# Altium schematic sheet io.SchDoc
size A
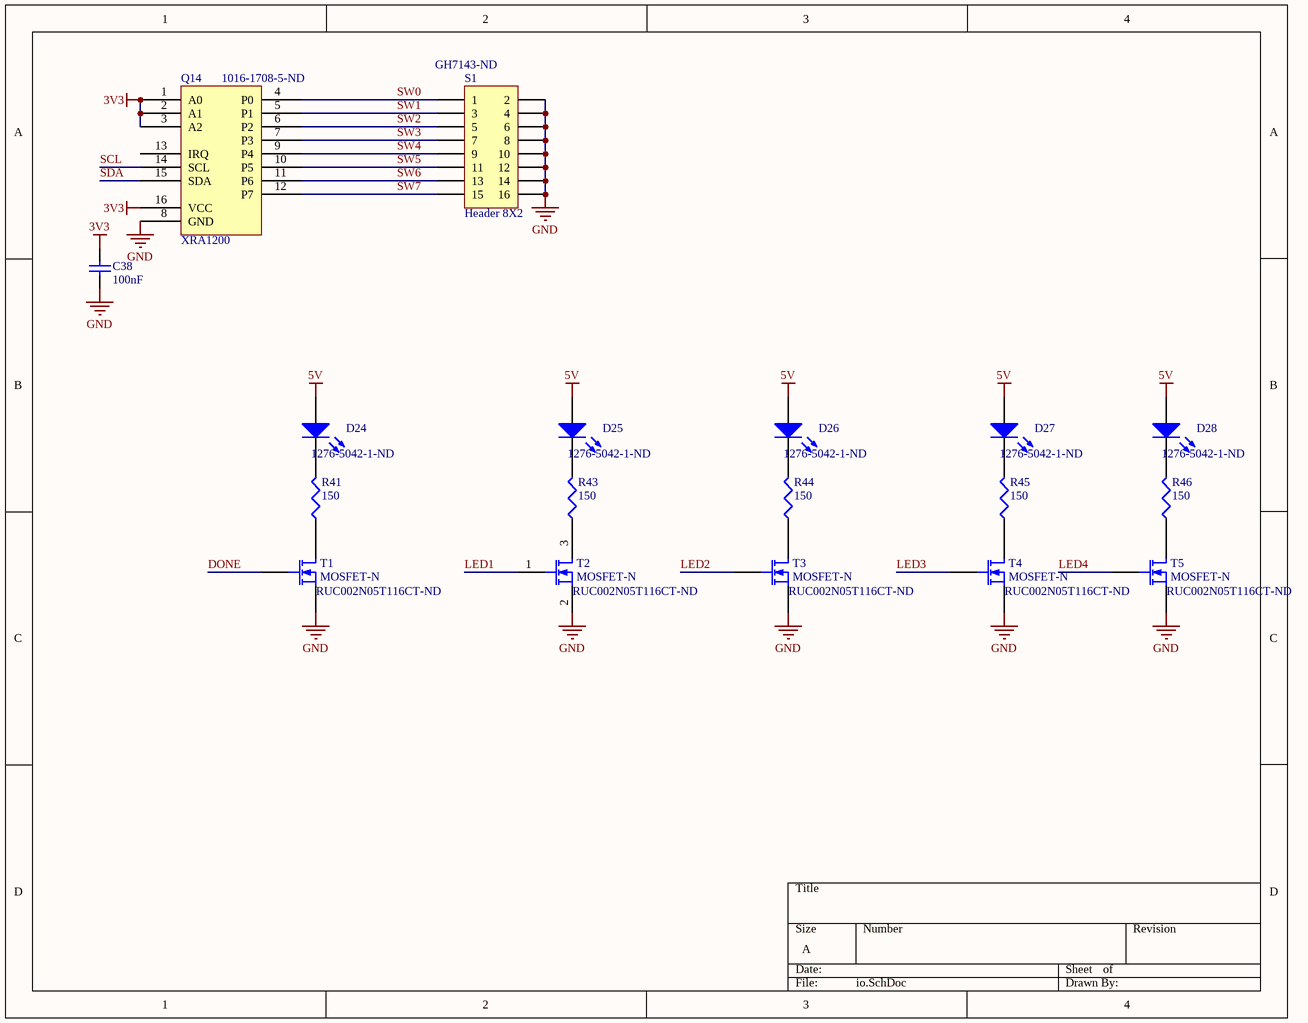
[diagram p0: io.SchDoc]

## Parts
C38  value 100nF  [CAPC1005X06L]  (hidden comment: Cap)
D24  LED2  [LED-0603]  (value not drawn)
D25  LED2  [LED-0603]  (value not drawn)
D26  LED2  [LED-0603]  (value not drawn)
D27  LED2  [LED-0603]  (value not drawn)
D28  LED2  [LED-0603]  (value not drawn)
Q14  XRA1200  Supplier Part Number 1: 1016-1708-5-ND  [TSOP65P640X120-16N]
R41  value 150  Supplier Part Number 1: 1276-5042-1-ND  [CAPC1608X90N]  (hidden comment: Res3)
R43  value 150  Supplier Part Number 1: 1276-5042-1-ND  [CAPC1608X90N]  (hidden comment: Res3)
R44  value 150  Supplier Part Number 1: 1276-5042-1-ND  [CAPC1608X90N]  (hidden comment: Res3)
R45  value 150  Supplier Part Number 1: 1276-5042-1-ND  [CAPC1608X90N]  (hidden comment: Res3)
R46  value 150  Supplier Part Number 1: 1276-5042-1-ND  [CAPC1608X90N]  (hidden comment: Res3)
S1  Header 8X2  Supplier Part Number 1: GH7143-ND  [76PSB08ST]
T1  MOSFET-N  Supplier Part Number 1: RUC002N05T116CT-ND  [SOT23-3]
T2  MOSFET-N  Supplier Part Number 1: RUC002N05T116CT-ND  [SOT23-3]
T3  MOSFET-N  Supplier Part Number 1: RUC002N05T116CT-ND  [SOT23-3]
T4  MOSFET-N  Supplier Part Number 1: RUC002N05T116CT-ND  [SOT23-3]
T5  MOSFET-N  Supplier Part Number 1: RUC002N05T116CT-ND  [SOT23-3]

## Nets
3V3: C38.2 Q14.1(A0) Q14.2(A1) Q14.3(A2) Q14.16(VCC)
5V: D24.A D25.A D26.A D27.A D28.A
GND: C38.1 Q14.8(GND) S1.2 S1.4 S1.6 S1.8 S1.10 S1.12 S1.14 S1.16 T1.2(S) T2.2(S) T3.2(S) T4.2(S) T5.2(S)
DONE: T1.1(G)
LED1: T2.1(G)
LED2: T3.1(G)
LED3: T4.1(G)
LED4: T5.1(G)
SCL: Q14.14(SCL)
SDA: Q14.15(SDA)
SW0: Q14.4(P0) S1.1
SW1: Q14.5(P1) S1.3
SW2: Q14.6(P2) S1.5
SW3: Q14.7(P3) S1.7
SW4: Q14.9(P4) S1.9
SW5: Q14.10(P5) S1.11
SW6: Q14.11(P6) S1.13
SW7: Q14.12(P7) S1.15
NetD24_K: D24.K R41.2
NetD25_K: D25.K R43.2
NetD26_K: D26.K R44.2
NetD27_K: D27.K R45.2
NetD28_K: D28.K R46.2
NetR41_1: R41.1 T1.3(D)
NetR43_1: R43.1 T2.3(D)
NetR44_1: R44.1 T3.3(D)
NetR45_1: R45.1 T4.3(D)
NetR46_1: R46.1 T5.3(D)

Not connected (* = marked no-connect by the designer): Q14 13(IRQ)

## Library data of the parts
C38 = Cap: Capacitor; Published: 8-Jun-2000; LatestRevisionDate: 17-Jul-2002; LatestRevisionNote: Re-released for DXP Platform.; PackageReference: RAD-0.3; Publisher: Altium Limited; PackageDescription: Radial Cap, Thru-Hole; 2 Leads; 0.3 in Pin Spacing
D24-D28 = LED2: Typical RED, GREEN, YELLOW, AMBER GaAs LED; Published: 8-Jun-2000; LatestRevisionDate: 17-Jul-2002; LatestRevisionNote: Re-released for DXP Platform.; PackageVersion: Feb-2002; PackageReference: 3.2X1.6X1.1; Publisher: Altium Limited; PackageDescription: SM LED; 2 Flat Leads; Supplier 1: Digi-Key; Supplier Part Number 1: 475-2512-1-ND
R41 R43-R46 = Res3: Resistor; Published: 8-Jun-2000; LatestRevisionDate: 29-May-2009; LatestRevisionNote: IPC-7351 Footprint Added.; PackageReference: J1-0603; Publisher: Altium Limited; PackageDescription: Chip Resistor; Supplier 1: Digi-Key
S1 = Header 8X2: Header, 8-Pin, Dual row; LatestRevisionDate: 17-Jul-2002; LatestRevisionNote: Re-released for DXP Platform.; Publisher: Altium Limited; Supplier 1: Digi-Key
T1-T5 = MOSFET-N: N-Channel MOSFET; Published: 8-Jun-2000; LatestRevisionDate: 17-Jul-2002; LatestRevisionNote: Re-released for DXP Platform.; PackageVersion: 1995/1996; PackageReference: E3; Publisher: Altium Limited; PackageDescription: TO, Flat Index; 3 In-Line, Axial Leads; Body Dia. 4.6mm; Lead Dia. 0.5 mm (max); Supplier 1: Digi-Key
Q14 = XRA1200: Supplier 1: Digi-Key